# Altium schematic sheet Sheet_1_2021-12-20.schdoc
size 49 x 27 mm
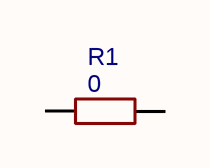
[diagram p0: Sheet_1_2021-12-20.schdoc]

## Parts
R1  0  [R0805]

## Nets

Not connected (* = marked no-connect by the designer): R1 1 2

## Library data of the parts
R1 = 0: BOM_Manufacturer: WTC; BOM_Manufacturer Part: WR08X000PTL; nameAlias: Resistance (Ohms); BOM_Supplier: LCSC; BOM_Supplier Part: C112378; BOM_JLCPCB Part Class: Extended Part; spicePre: R; spiceSymbolName: WR08X000PTL